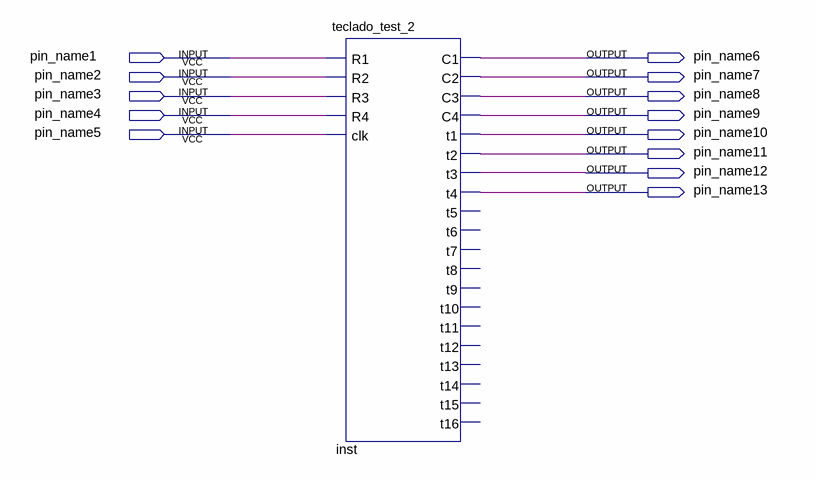
[diagram p0: schematic sheet]
// Quartus schematic bloque_prueba.bdf as structural Verilog: 1 symbols, 13 pins
module bloque_prueba (
  input  pin_name1,
  input  pin_name2,
  input  pin_name3,
  input  pin_name4,
  input  pin_name5,
  output pin_name6,
  output pin_name7,
  output pin_name8,
  output pin_name9,
  output pin_name10,
  output pin_name11,
  output pin_name12,
  output pin_name13
);

  teclado_test_2 inst (
    .R1(pin_name1), .R2(pin_name2), .R3(pin_name3), .R4(pin_name4), .clk(pin_name5), .C1(pin_name6),
    .C2(pin_name7), .C3(pin_name8), .C4(pin_name9), .t1(pin_name10), .t2(pin_name11), .t3(pin_name12),
    .t4(pin_name13));  // open: t5, t6, t7, t8, t9, t10, t11, t12, t13, t14, t15, t16
endmodule
